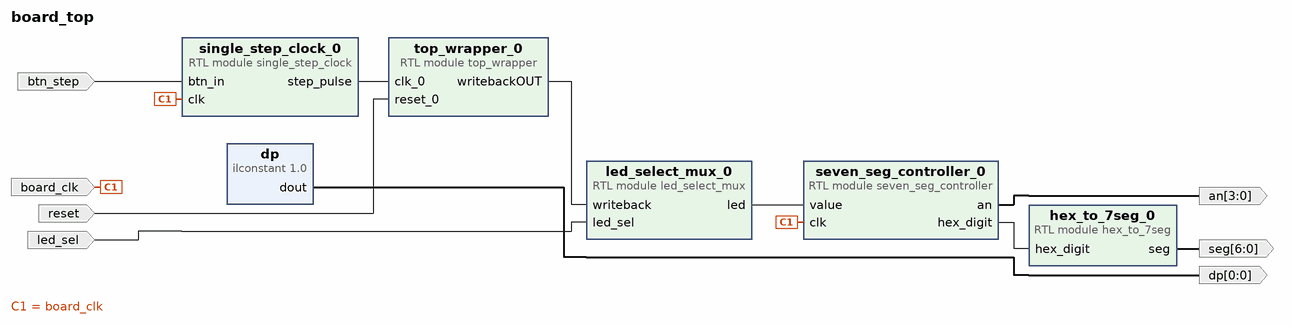
[diagram p0: block diagram of the top level]
# Vivado block design board_top, xc7a35tcpg236-1, Vivado 2025.1
create_bd_design board_top

create_bd_port -dir I board_clk
create_bd_port -dir I btn_step
create_bd_port -dir I reset
create_bd_port -dir I led_sel
create_bd_port -dir O -from 0 -to 0 dp
create_bd_port -dir O -from 6 -to 0 seg
create_bd_port -dir O -from 3 -to 0 an

create_bd_cell -type module -reference top_wrapper top_wrapper_0
create_bd_cell -type module -reference single_step_clock single_step_clock_0
create_bd_cell -type module -reference led_select_mux led_select_mux_0
create_bd_cell -type module -reference seven_seg_controller seven_seg_controller_0
create_bd_cell -type module -reference hex_to_7seg hex_to_7seg_0
create_bd_cell -type inline_hdl -vlnv xilinx.com:inline_hdl:ilconstant:1.0 dp

# ---- connections ----

connect_bd_net [get_bd_ports board_clk] [get_bd_pins seven_seg_controller_0/clk] [get_bd_pins single_step_clock_0/clk]
connect_bd_net [get_bd_ports btn_step] [get_bd_pins single_step_clock_0/btn_in]
connect_bd_net [get_bd_pins dp/dout] [get_bd_ports dp]
connect_bd_net [get_bd_pins hex_to_7seg_0/seg] [get_bd_ports seg]
connect_bd_net [get_bd_ports led_sel] [get_bd_pins led_select_mux_0/led_sel]
connect_bd_net [get_bd_pins led_select_mux_0/led] [get_bd_pins seven_seg_controller_0/value]
connect_bd_net [get_bd_ports reset] [get_bd_pins top_wrapper_0/reset_0]
connect_bd_net [get_bd_pins seven_seg_controller_0/an] [get_bd_ports an]
connect_bd_net [get_bd_pins seven_seg_controller_0/hex_digit] [get_bd_pins hex_to_7seg_0/hex_digit]
connect_bd_net [get_bd_pins single_step_clock_0/step_pulse] [get_bd_pins top_wrapper_0/clk_0]
connect_bd_net [get_bd_pins top_wrapper_0/writebackOUT] [get_bd_pins led_select_mux_0/writeback]

validate_bd_design
save_bd_design
